# Altium project Mixed_Signal_Board.PrjPcb (part 2 of 2)

## Sheet [11] - Power_Input_And_Regulators.SchDoc
size 420 x 297 mm; DocumentNumber: 11; SheetNumber: 11; SheetTotal: 11
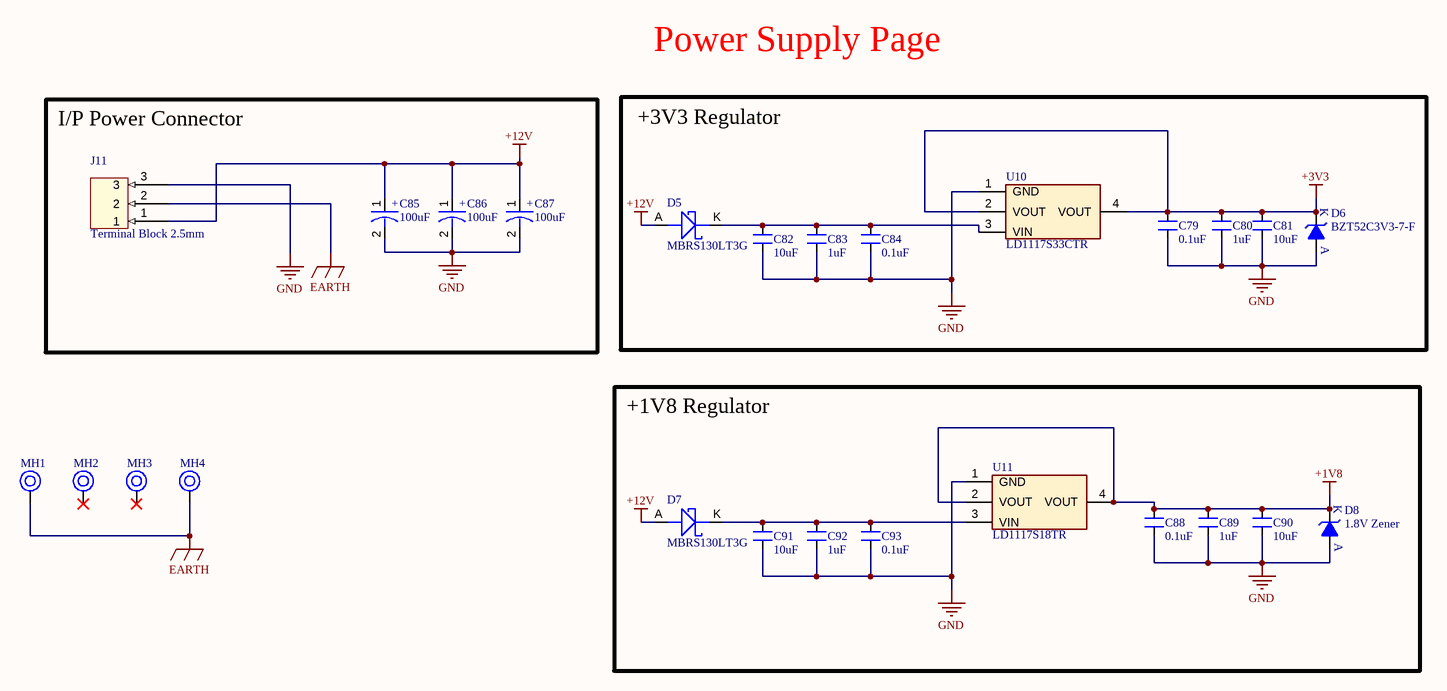
[diagram p10: [11] - Power_Input_And_Regulators.SchDoc]

### Parts
C79  0.1uF  [CAP_0805]
C80  1uF  [CAP_0805]
C81  10uF  [CAP_1206]
C82  10uF  [CAP_1206]
C83  1uF  [CAP_0805]
C84  0.1uF  [CAP_0805]
C85  100uF  [ACAP_P305_D393_H393_RAD]
C86  100uF  [ACAP_P305_D393_H393_RAD]
C87  100uF  [ACAP_P305_D393_H393_RAD]
C88  0.1uF  [CAP_0805]
C89  1uF  [CAP_0805]
C90  10uF  [CAP_1206]
C91  10uF  [CAP_1206]
C92  1uF  [CAP_0805]
C93  0.1uF  [CAP_0805]
D5  MBRS130LT3G  [DIO_SMB_DO-214AA]
D6  BZT52C3V3-7-F  [DIO_SOD-123]
D7  MBRS130LT3G  [DIO_SMB_DO-214AA]
D8  1.8V Zener  [DIO_DO-213AB_SMD]
J11  Terminal Block 2.5mm  [CON3_100_TB_TH_ST]
MH1  Mounting Hole  [MOUNTING]  (value not drawn)
MH2  Mounting Hole  [MOUNTING]  (value not drawn)
MH3  Mounting Hole  [MOUNTING]  (value not drawn)
MH4  Mounting Hole  [MOUNTING]  (value not drawn)
U10  LD1117S33CTR  [SOT223_3]
U11  LD1117S18TR  [SOT223_3]

### Blocks framed on the sheet
I/P Power Connector: C85-C87 J11
+3V3 Regulator: C79-C84 D5 D6 U10
+1V8 Regulator: C88-C93 D7 D8 U11

### Nets
+1V8: C88.1 C89.1 C90.1 D8.K U11.2(VOUT) U11.4(VOUT)
+3V3: C79.1 C80.1 C81.1 D6.K U10.2(VOUT) U10.4(VOUT)
+12V: C85.1 C86.1 C87.1 D5.A D7.A J11.1
EARTH: J11.2 MH1.1 MH4.1
GND: C79.2 C80.2 C81.2 C82.1 C83.1 C84.1 C85.2 C86.2 C87.2 C88.2 C89.2 C90.2 C91.1 C92.1 C93.1 D6.A D8.A J11.3 U10.1(GND) U11.1(GND)  [project net SN]
NetC82_2: C82.2 C83.2 C84.2 D5.K U10.3(VIN)
NetC91_2: C91.2 C92.2 C93.2 D7.K U11.3(VIN)

Not connected (* = marked no-connect by the designer): MH2 1*; MH3 1*

### Notes on the sheet
- Power Supply Page
- THIS DOCUMENT AND THE DATA DISCLOSED HEREIN OR
- HEREWITH IS THE PROPERTY OF ALTIUM LIMITED AND MAY
- DWG NO:
- REVISION
- REV:
- DESCRIPTION
- DATE
- APPROVED
- BE FREELY DISTRIBUTED IN WHOLE. NO RIGHTS ARE
- RESERVED OR EXPRESS OR IMPLIED WARANTEE GIVEN.
- ENG:
- APPROVALS
- PROJECT
- DSN:
- CHK:
- REFERENCE DOCUMENTS
- PROJECT REVISION:
- TITLE
- DOCUMENT REVISION:
- DESIGN ITEM:
- BOM:
- FAB DWG:
- PCB DWG:
- ASSY DWG:
- SCALE:
- A3
- SIZE
- CAGE CODE
- FILE NAME
- DWG NO.
- SHEET
- OF
- REV
- (in symbol CAP-P_100uF-50V-20%-RAD) +

### Library data of the parts
C79 C84 C88 C93 = CAP_0.1uF-50V-5%-0805: 0.1µF ±5% 50V Ceramic Capacitor X7R 0805 (2012 Metric); Manufacturer: AVX Corporation; Manufacturer Part Number: 08055C104JAT4A; Alternate Part Number-1: 0805B104M500; Case/Package: 0805; Supplier-1: SIRICOM; Supplier Part Number-1: 0805B104J500CT
C80 C83 C89 C92 = CAP_1uF-50V-5%-0805: 1µF ±5% 50V Ceramic Capacitor X7R 0805 (2012 Metric); Manufacturer: Samsung; Manufacturer Part Number: CC0805JKX7R9BB105; Alternate Part Number-1: 0805F105M500NT; Case/Package: 0805; Supplier-1: SIRICOM; Supplier Part Number-1: CL21B105KBFNNNE
C81 C82 C90 C91 = CAP_10uF-50V-10%-1206: 10µF ±10% 50V Ceramic Capacitor X7R 1206 (3216 Metric); Manufacturer: KEMET; Manufacturer Part Number: CL31B106KBHNNNE; Alternate Part Number-1: GRT31CR61H106ME01L; Case/Package: 1206; Supplier-1: SIRICOM; Supplier Part Number-1: CC1206KKX5R9BB106
C85-C87 = CAP-P_100uF-50V-20%-RAD: 100µF 50V Aluminum Polymer Capacitor Radial, Can - SMD 28mOhm 4000 Hrs @ 125°C; Manufacturer: Nichicon; Manufacturer Part Number: GYA1H101MCQ1GS; Alternate Part Number-1: VEU101M1HTR-1010; Case/Package: Radial-SMD; Supplier-1: SP ROAD; Supplier Part Number-1: GYA1H101MCQ1GS
D5 D7 = DIO-S_445mV-30V-2A-SMB: Diode Schottky 30V 2A Surface Mount SMB; Manufacturer: ON Semiconductor; Alternate Part Number-1: NA; Manufacturer Part Number: MBRS130LT3G; Case/Package: SMB; Supplier-1: ARROW; Supplier Part Number-1: MBRS130LT3G
D6 = DIO-Z_3.3V-500mW-SOD123: Zener Diode 3.3V 500mW ±6% Surface Mount SOD-123; Manufacturer: Diodes Incorporated; Alternate Part Number-1: NA; Manufacturer Part Number: BZT52C3V3-7-F; Case/Package: SOD-123; Supplier-1: Digikey; Supplier Part Number-1: BZT52C3V3-FDICT-ND
D8 = DIO-Z_1.8V-500mW-DO213AA: Zener Diode 1.8V 500mW ±5% Surface Mount DO-213AA; Manufacturer: *; Manufacturer Part Number: *; Case/Package: *; Supplier-1: *; Supplier Part Number-1: *; Alternate Part Number-1: *
J11 = CON-TB_3X1-100-ST-TH: 3 Pins, 1 Row 2.54mm Pitch, straight Connector, male; Manufacturer Part Number: 1725669; Manufacturer: Phoenix Contact; Alternate Part Number-1: NA; Case/Package: TH-CON; Supplier-1: SP ROAD; Supplier Part Number-1: 1725669
MH1-MH4 = MH_3.5H_6D: Manufacturer Part Number: NA; Case/Package: TH; Manufacturer: NA; Supplier-1: NA; Supplier Part Number-1: NA; Alternate Part Number-1: NA
U10 = REG_15V-3.3V-0.9A-12W-SOT223: Linear Voltage Regulator IC 1 Output 800mA SOT-223; Manufacturer: STMicroelectronics; Alternate Part Number-1: NA; Manufacturer Part Number: LD1117S33CTR; Case/Package: SOT223; Supplier-1: SP ROAD; Supplier Part Number-1: LD1117S33CTR
U11 = REG_15V-1.8V-0.8A-1.4W-SOT223: LDO Voltage Regulators 1.8V 0.8A Positive; Manufacturer: STMicroelectronics; Alternate Part Number-1: NA; Manufacturer Part Number: LD1117S18TR; Case/Package: SOT-223-3; Supplier-1: Mouser; Supplier Part Number-1: 511-LD1117S18-TR

## Nets that join several sheets
+1V8: [8] - DAC_And_MIC (C40.1 C41.2 FB3.2 U6.34), [11] - Power_Input_And_Regulators (6 pins)
+3V3: [3] - STM32F103_Debugger (14 pins), [4] - EthernetPHY (10 pins), [5] - Motor_Driver (R22.2), [6] - CH340C (C?#1.2 U?#1.4 U?#1.16), [7] - ADC_Chip (8 pins), [8] - DAC_And_MIC (12 pins), [9] - STM32F407_Controller (21 pins), [10] - Motor_Driver_2 (R?#14.2), [11] - Power_Input_And_Regulators (6 pins)
+12V: [5] - Motor_Driver (7 pins), [10] - Motor_Driver_2 (7 pins), [11] - Power_Input_And_Regulators (6 pins)
EARTH: [4] - EthernetPHY (C21.1 R11.1), [11] - Power_Input_And_Regulators (J11.2 MH1.1 MH4.1)
SN: [3] - STM32F103_Debugger (19 pins), [4] - EthernetPHY (20 pins), [5] - Motor_Driver (12 pins), [6] - CH340C (C?#1.1 J?#1.5 J?#1.6 U?#1.1), [7] - ADC_Chip (10 pins), [8] - DAC_And_MIC (24 pins), [9] - STM32F407_Controller (29 pins), [10] - Motor_Driver_2 (11 pins), [11] - Power_Input_And_Regulators (20 pins)
COL: [4] - EthernetPHY (DS1.A U2.28), [9] - STM32F407_Controller (U8.26)
CRS: [4] - EthernetPHY (DS2.A U2.29), [9] - STM32F407_Controller (U8.23)
NetR9_1: [4] - EthernetPHY (R9.1 U2.11), [9] - STM32F407_Controller (U8.25)
NetR23_1: [5] - Motor_Driver (R23.1 U3.14), [9] - STM32F407_Controller (U8.45)
NetR?#1_1: [7] - ADC_Chip (R?#1.1 U?#2.3), [9] - STM32F407_Controller (U8.55)
NetR?#2_1: [7] - ADC_Chip (R?#2.1 U?#2.16), [8] - DAC_And_MIC (U6.2), [9] - STM32F407_Controller (U8.92)
NetR?#3_1: [7] - ADC_Chip (R?#3.1 U?#2.15), [8] - DAC_And_MIC (U6.1), [9] - STM32F407_Controller (U8.93)
NetR?#17_1: [9] - STM32F407_Controller (U8.66), [10] - Motor_Driver_2 (R?#17.1 U?#3.14)
NetU1_18: [3] - STM32F103_Debugger (U1.18), [9] - STM32F407_Controller (U8.76)
NetU1_25: [3] - STM32F103_Debugger (U1.25 U1.27), [9] - STM32F407_Controller (U8.72)
NetU2_12: [4] - EthernetPHY (U2.12), [9] - STM32F407_Controller (U8.16)
NetU2_13: [4] - EthernetPHY (U2.13), [9] - STM32F407_Controller (U8.36)
NetU2_14: [4] - EthernetPHY (U2.14), [9] - STM32F407_Controller (U8.35)
NetU2_15: [4] - EthernetPHY (U2.15), [9] - STM32F407_Controller (U8.34)
NetU2_16: [4] - EthernetPHY (U2.16), [9] - STM32F407_Controller (U8.33)
NetU2_18: [4] - EthernetPHY (U2.18), [9] - STM32F407_Controller (U8.32)
NetU2_19: [4] - EthernetPHY (U2.19), [9] - STM32F407_Controller (U8.24)
NetU2_20: [4] - EthernetPHY (U2.20), [9] - STM32F407_Controller (U8.47)
NetU2_22: [4] - EthernetPHY (U2.22), [9] - STM32F407_Controller (U8.18)
NetU2_23: [4] - EthernetPHY (U2.23), [9] - STM32F407_Controller (U8.48)
NetU2_24: [4] - EthernetPHY (U2.24), [9] - STM32F407_Controller (U8.51)
NetU2_25: [4] - EthernetPHY (U2.25), [9] - STM32F407_Controller (U8.52)
NetU2_26: [4] - EthernetPHY (U2.26), [9] - STM32F407_Controller (U8.17)
NetU2_27: [4] - EthernetPHY (U2.27), [9] - STM32F407_Controller (U8.1)
NetU3_11: [5] - Motor_Driver (U3.11), [9] - STM32F407_Controller (U8.30)
NetU3_15: [5] - Motor_Driver (U3.15), [9] - STM32F407_Controller (U8.63)
NetU6_37: [8] - DAC_And_MIC (U6.37), [9] - STM32F407_Controller (U8.29)
NetU6_38: [8] - DAC_And_MIC (U6.38), [9] - STM32F407_Controller (U8.89)
NetU6_39: [8] - DAC_And_MIC (U6.39), [9] - STM32F407_Controller (U8.80)
NetU6_40: [8] - DAC_And_MIC (U6.40), [9] - STM32F407_Controller (U8.90)
NetU7_3: [8] - DAC_And_MIC (U7.3), [9] - STM32F407_Controller (U8.65)
NetU7_4: [8] - DAC_And_MIC (U7.4), [9] - STM32F407_Controller (U8.53)
NetU8_31: [9] - STM32F407_Controller (U8.31), [10] - Motor_Driver_2 (U?#3.11)
NetU8_56: [7] - ADC_Chip (U?#2.14), [9] - STM32F407_Controller (U8.56)
NetU8_57: [6] - CH340C (U?#1.14), [9] - STM32F407_Controller (U8.57)
NetU8_60: [9] - STM32F407_Controller (U8.60), [10] - Motor_Driver_2 (U?#3.15)
NetU8_78: [6] - CH340C (U?#1.2), [9] - STM32F407_Controller (U8.78)
NetU8_79: [6] - CH340C (U?#1.3), [9] - STM32F407_Controller (U8.79)
nFAULT: [5] - Motor_Driver (R21.1 U3.9), [9] - STM32F407_Controller (U8.62)
nFAULT_2: [9] - STM32F407_Controller (U8.59), [10] - Motor_Driver_2 (R?#16.1 U?#3.9)
NTRST_F407: [3] - STM32F103_Debugger (U1.26), [9] - STM32F407_Controller (C57.2 R34.1 SW3.2 U8.14)
PHY_RESET: [4] - EthernetPHY (R7.1 SW2.2 U2.32), [9] - STM32F407_Controller (U8.64)
RESET_DAC: [8] - DAC_And_MIC (R31.1 U6.32), [9] - STM32F407_Controller (U8.54)
SNSOUT: [5] - Motor_Driver (R20.1 U3.10), [9] - STM32F407_Controller (U8.61)
SNSOUT_2: [9] - STM32F407_Controller (U8.58), [10] - Motor_Driver_2 (R?#15.1 U?#3.10)